# EAGLE design ug_in_A (EAGLE 9.0.1)
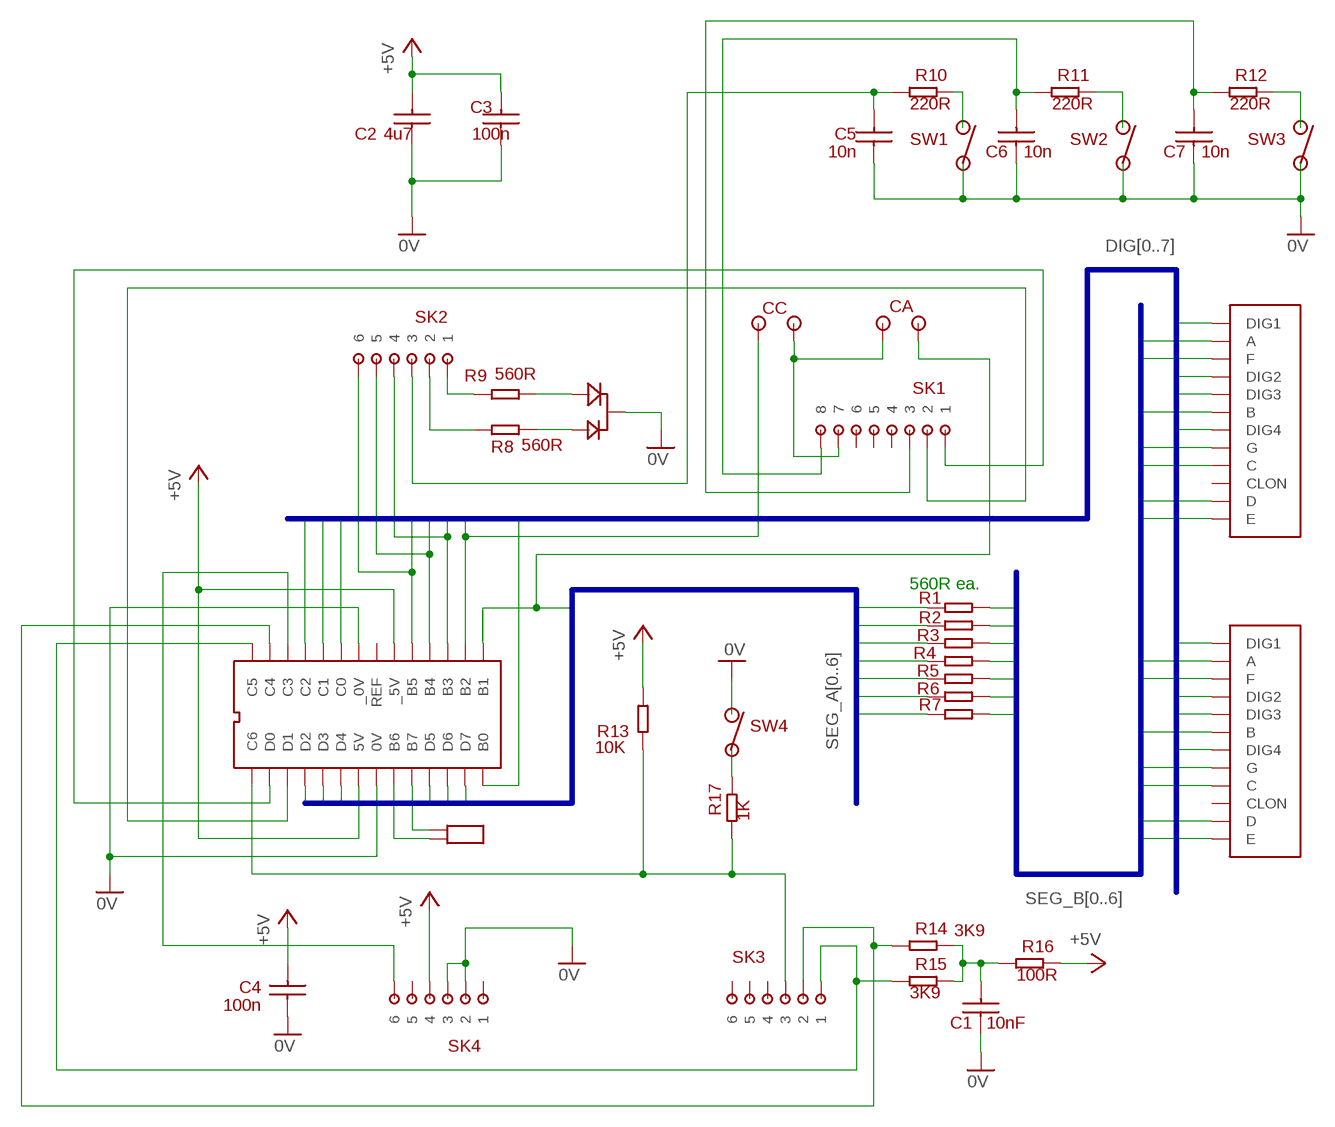
[diagram p0: schematic, sheet 1]

## Parts
C1  10nF  CAPACITOR  [1206]
C2  4u7  CAPACITOR  [1206]
C3  100n  CAPACITOR  [1206]
C4  100n  CAPACITOR  [1206]
C5  10n  CAPACITOR  [1206]
C6  10n  CAPACITOR  [1206]
C7  10n  CAPACITOR  [1206]
CA  CA_LINK  [CA_LINK]
CC  CA_LINK  [CA_LINK]
R1  560R  RESISTOR  [1206]
R2  560R  RESISTOR  [1206]
R3  560R  RESISTOR  [1206]
R4  560R  RESISTOR  [1206]
R5  560R  RESISTOR  [1206]
R6  560R  RESISTOR  [1206]
R7  560R  RESISTOR  [1206]
R8  560R  RESISTOR  [1206]
R9  560R  RESISTOR  [1206]
R10  220R  RESISTOR  [1206]
R11  220R  RESISTOR  [1206]
R12  220R  RESISTOR  [1206]
R13  10K  RESISTOR  [1206]
R14  3K9  RESISTOR  [1206]
R15  3K9  RESISTOR  [1206]
R16  100R  RESISTOR  [1206]
R17  1K  RESISTOR  [1206]
SK1  8_WAY_HEADER  [8_WAY_HEADER]
SK2  6_WAY_HEADER  [6_WAY_HEADER]
SK3  6_WAY_HEADER  [6_WAY_HEADER]
SK4  6_WAY_HEADER  [6_WAY_HEADER]
SW1  BP_TH_NO  [PB_NO_TH]
SW2  BP_TH_NO  [PB_NO_TH]
SW3  BP_TH_NO  [PB_NO_TH]
SW4  PUSH_BUTTON_NO_SM  [PUSH_BUTTON_NO_SM]
U$2  ATMEGA328DIP28_3  [DIL28-3]
U$3  DISPLAY  [DISPLAY]
U$4  DISPLAY  [DISPLAY]
U$5  CC_LED  [DUAL_LED]
U$16  CRYSTAL  [CRYSTAL]

## Nets
0V: C1.P$1 C2.P$1 C3.P$1 C4.P$1 C5.P$1 C6.P$1 C7.P$1 SK4.P$2 SK4.P$3 SW1.P$2 SW2.P$2 SW3.P$2 SW4.P$1 U$2.8(0V) U$2.22(_0V) U$5.P$2
+5V: C2.P$2 C3.P$2 C4.P$2 R13.P$2 R16.P$2 SK4.P$4 U$2.7(5V) U$2.20(_5V)
DIG0: SK2.P$6 U$2.19(B5) U$3.P$12(DIG1)
DIG1: U$2.23(C0) U$3.P$9(DIG2)
DIG2: U$2.24(C1) U$3.P$8(DIG3)
DIG3: U$2.25(C2) U$3.P$6(DIG4)
DIG4: U$2.14(B0) U$4.P$12(DIG1)
DIG5: CC.P$2 U$2.16(B2) U$4.P$9(DIG2)
DIG6: SK2.P$4 U$2.17(B3) U$4.P$8(DIG3)
DIG7: SK2.P$5 U$2.18(B4) U$4.P$6(DIG4)
N$1: R8.P$1 U$5.P$1
N$2: SK4.P$6 U$2.26(C3)
N$3: U$2.10(B7) U$16.P$1
N$4: R9.P$1 U$5.P$3
N$5: R9.P$2 SK2.P$1
N$6: R8.P$2 SK2.P$2
N$7: SK1.P$1 U$2.2(D0)
N$8: SK1.P$2 U$2.3(D1)
N$9: R15.P$1 SK3.P$1 U$2.28(C5)
N$10: R14.P$1 SK3.P$2 U$2.27(C4)
N$11: R17.P$2 SW4.P$2
N$12: R10.P$2 SW1.P$1
N$13: R11.P$2 SW2.P$1
N$14: R12.P$2 SW3.P$1
N$15: C7.P$2 R12.P$1 SK1.P$3
N$16: U$2.9(B6) U$16.P$2
N$17: C5.P$2 R10.P$1 SK2.P$3
N$18: C6.P$2 R11.P$1 SK1.P$8
N$19: C1.P$2 R14.P$2 R15.P$2 R16.P$1
N$20: R13.P$1 R17.P$1 SK3.P$3 U$2.1(C6)
N$23: CA.P$2 CC.P$1 SK1.P$7
SEG_A0: CA.P$1 R1.P$1 U$2.15(B1)
SEG_A1: R2.P$1 U$2.4(D2)
SEG_A2: R3.P$1 U$2.5(D3)
SEG_A3: R4.P$1 U$2.6(D4)
SEG_A4: R5.P$1 U$2.11(D5)
SEG_A5: R6.P$1 U$2.12(D6)
SEG_A6: R7.P$1 U$2.13(D7)
SEG_B0: R1.P$2 U$3.P$11(A) U$4.P$11(A)
SEG_B1: R2.P$2 U$3.P$7(B) U$4.P$7(B)
SEG_B2: R3.P$2 U$3.P$4(C) U$4.P$4(C)
SEG_B3: R4.P$2 U$3.P$2(D) U$4.P$2(D)
SEG_B4: R5.P$2 U$3.P$1(E) U$4.P$1(E)
SEG_B5: R6.P$2 U$3.P$10(F) U$4.P$10(F)
SEG_B6: R7.P$2 U$3.P$5(G) U$4.P$5(G)
Unconnected: SK1.P$4 SK1.P$5 SK1.P$6 SK3.P$4 SK3.P$5 SK3.P$6 SK4.P$1 SK4.P$5 U$2.21(REF) U$3.P$3(CLON) U$4.P$3(CLON)

## Buses
SEG_A[0..6]
SEG_B[0..6]
DIG[0..7]

## Notes on the sheet
- 560R ea.

## Library data of the parts
C1-C7 = 1_home_library:CAPACITOR
CA CC = 1_home_library:CA_LINK
R1-R17 = 1_home_library:RESISTOR
SK1 = 1_home_library:8_WAY_HEADER
SK2-SK4 = 1_home_library:6_WAY_HEADER
SW1-SW3 = 1_home_library:BP_TH_NO
SW4 = 1_home_library:PUSH_BUTTON_NO_SM
U$2 = 1_home_library:ATMEGA328
U$3 U$4 = 1_home_library:DISPLAY
U$5 = 1_home_library:CC_LED
U$16 = 1_home_library:CRYSTAL

## Board
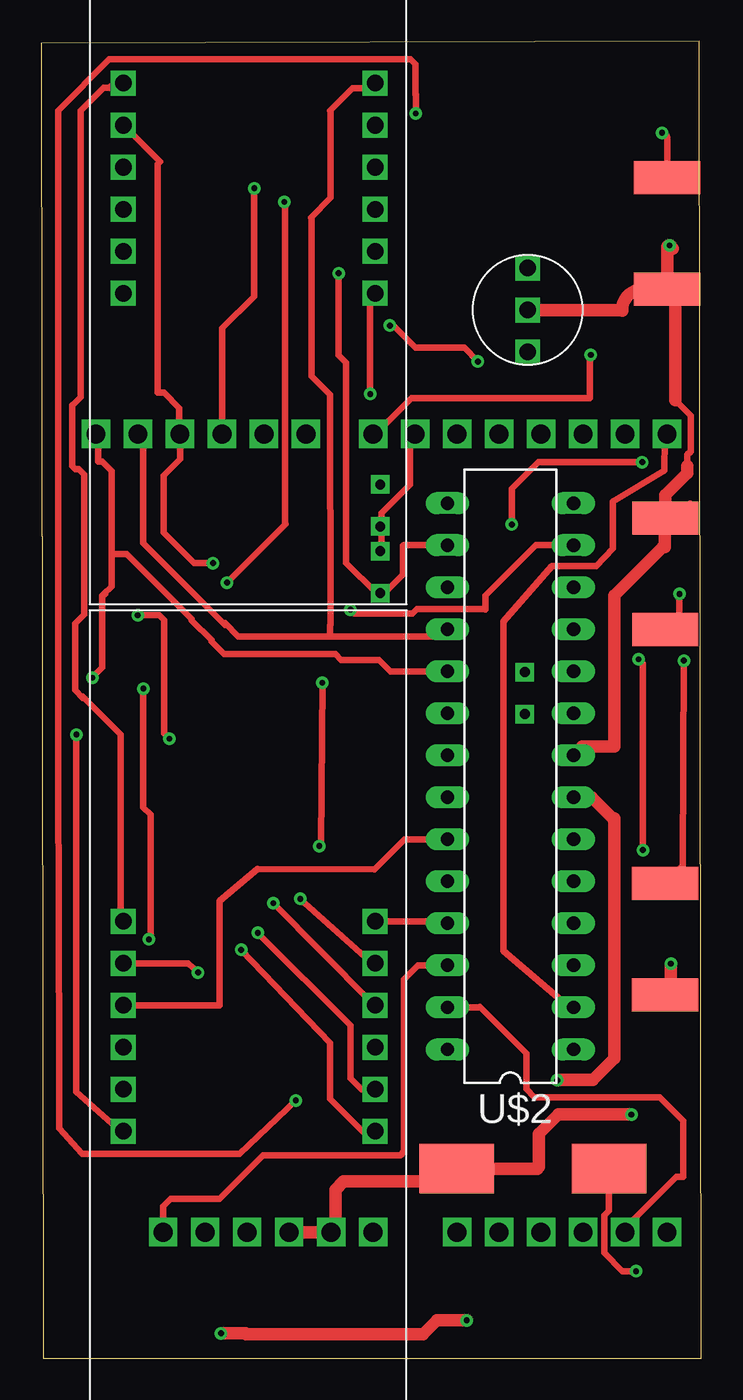
[diagram p1: board, top side]
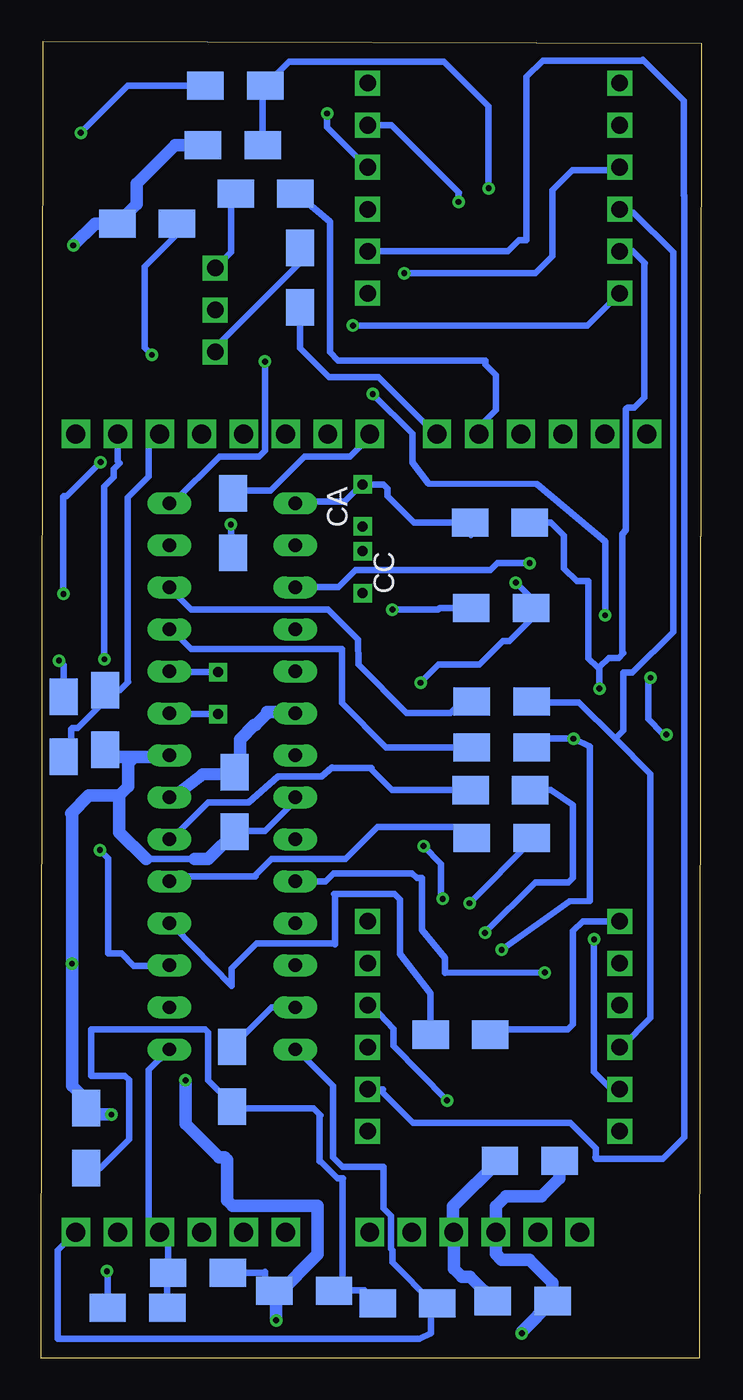
[diagram p2: board, bottom side, seen from below]

Size 39.93 x 79.62 mm. Coordinates in mm from the lower left corner, seen from the top.
Outline: 0.13,0 39.93,0 39.8,79.62 0,79.49 0.13,0
Copper layers (1*16): Top 0.035mm / dielectric 1.5mm / Bottom 0.035mm
Design rules "default *": minimum track width 15mil, minimum drill 0.35mm, track to track 12mil, track to pad 8mil, pad to pad 8mil, via to via 8mil, smd to smd 8mil, copper to edge 15mil, drill to drill 6mil, minimum pad ring 10mil, minimum via ring 8mil, stop-mask expansion 4mil, vias tented up to drill 0mil, thermal gap 10mil

### Footprints (pad centres in the part's own frame; a part is rotated, then mirrored left to right if it is on the bottom)
1206 = smd 2.2 x 1.7: P$1 0,0; P$2 3.61,0
CA_LINK = drill 0.6 square: P$1 0,2.54; P$2 0,0
8_WAY_HEADER = drill 1.143 square: P$1 0,0; P$2 0,-2.54; P$3 0,-5.08; P$4 0,-7.62; P$5 0,-10.16; P$6 0,-12.7; P$7 0,-15.24; P$8 0,-17.78
6_WAY_HEADER = drill 1.143 square: P$1 0,0; P$2 0,-2.54; P$3 0,-5.08; P$4 0,-7.62; P$5 0,-10.16; P$6 0,-12.7
PB_NO_TH = smd 2 x 4: P$1 0,0; P$2 6.75,0
PUSH_BUTTON_NO_SM = smd 3 x 4.5: P$1 -0.03,-0.78; P$2 -0.03,8.42
DIL28-3 = drill 0.813 long: 1 -16.51,-3.81; 2 -13.97,-3.81; 3 -11.43,-3.81; 4 -8.89,-3.81; 5 -6.35,-3.81; 6 -3.81,-3.81; 7 -1.27,-3.81; 8 1.27,-3.81; 9 3.81,-3.81; 10 6.35,-3.81; 11 8.89,-3.81; 12 11.43,-3.81; 13 13.97,-3.81; 14 16.51,-3.81; 15 16.51,3.81; 16 13.97,3.81; 17 11.43,3.81; 18 8.89,3.81; 19 6.35,3.81; 20 3.81,3.81; 21 1.27,3.81; 22 -1.27,3.81; 23 -3.81,3.81; 24 -6.35,3.81; 25 -8.89,3.81; 26 -11.43,3.81; 27 -13.97,3.81; 28 -16.51,3.81
DISPLAY = drill 1 square: P$1 0,0; P$2 2.54,0; P$3 5.08,0; P$4 7.62,0; P$5 10.16,0; P$6 12.7,0; P$7 12.7,15.24; P$8 10.16,15.24; P$9 7.62,15.24; P$10 5.08,15.24; P$11 2.54,15.24; P$12 0,15.24
DUAL_LED = drill 1 square: P$1 0,2.54; P$2 0,0; P$3 0,-2.54
CRYSTAL = drill 0.6 square: P$1 0,0; P$2 0,-2.54

### Placement (x,y rotation side)
C1  37.21,15.11 270 bottom
C2  12.62,3.45 0 bottom
C3  28.24,31.83 90 bottom
C4  12.19,11.94 0 bottom
C5  30.15,73.33 0 bottom
C6  35.33,68.61 0 bottom
C7  36.07,36.78 90 bottom
CA  20.5,50.29 0 bottom
CC  20.5,46.25 0 bottom
R1  14,50.52 0 bottom
R2  16.38,19.56 0 bottom
R3  13.89,31.45 0 bottom
R4  13.97,34.34 0 bottom
R5  13.89,36.93 0 bottom
R6  13.89,39.7 0 bottom
R7  13.92,45.36 0 bottom
R8  28.17,70.41 0 bottom
R9  24.28,67.13 270 bottom
R10  26.39,76.94 180 bottom
R11  28.32,52.3 270 bottom
R12  38.58,36.37 90 bottom
R13  32.26,5.16 0 bottom
R14  28.4,18.82 270 bottom
R15  15.98,3.33 180 bottom
R16  22.23,4.06 180 bottom
R17  32.31,3.05 180 bottom
SK1  37.85,55.88 270 top
SK2  16,55.88 270 top
SK3  37.85,7.62 270 top
SK4  20.07,7.62 270 top
SW1  37.85,71.37 270 top
SW2  37.74,44.04 90 top
SW3  37.72,28.7 270 top
SW4  25.91,11.43 270 top
U$2  28.37,35.18 90 top
U$3  20.19,13.72 90 top
U$4  20.19,64.39 90 top
U$5  29.41,63.37 0 top
U$16  29.24,41.48 0 top

### Tracks (layer width: path | path; a pad name or v marks a point on that pad's centre or on a via)
0V  (via drill 0.35)
  Top 0.381: 32.23,36.35 U$2.8 32.23,36.69 | SW2.P$2 37.72,50.24 39.25,51.67 | SW4.P$1 25.25,11.46 | 29.99,11.46 30,11.46 30.1,11.56 | 38.08,22.31 SW3.P$2 | 29.15,63.44 U$5.P$2 29.49,63.44 | 39.08,53.95 39.08,54.64 39.27,54.83 39.27,57 38.35,57.91
  Top 0.762: 37.72,50.24 37.72,49.03 37.58,49.03 34.65,46.1 34.65,36.98 32.72,36.98 U$2.8 | 29.99,11.46 25.25,11.46 24.48,10.69 18.29,10.69 17.78,10.19 17.78,7.87 SK4.P$2 SK4.P$3 | 30.1,11.56 30.1,13.56 31.27,14.73 v35.69,14.73 | v38.08,23.85 38.08,22.31 | SW2.P$2 37.74,52.17 39.08,53.51 39.08,53.95 | U$5.P$2 35.13,63.37 | 35.13,63.37 35.15,63.35 | 38.2,67.08 v38,67.28 arc90 37.85,67.13 SW1.P$2 | SW1.P$2 arc-90 38.35,64.12 38.35,57.91 | 35.13,63.37 arc-90 36.38,64.62 SW1.P$2
  Bottom 0.381: U$2.22 24.69,33.6 26.4,31.89 28.12,31.89 C3.P$1 28.46,31.55 | 32.23,36.35 U$2.8 32.23,36.69 | 37.03,15.43 C1.P$1 36.83,14.73 | 33.6,30.18 30.67,30.18 | 12.34,12 C4.P$1 | 29.49,63.44 U$5.P$2
  Bottom 0.762: v35.69,14.73 36.83,14.73 | C4.P$1 12.27,11.94 15.04,9.17 15.04,7.67 SK4.P$3 14.99,5.41 14.5,4.93 14.02,4.93 13.16,4.06 13.16,3.61 12.78,3.61 C2.P$1 | 37.03,15.43 38.08,16.47 v38.08,23.85 38.08,32.89 38.12,32.94 37.06,34.01 35.23,34.01 | 35.23,34.01 34.67,34.57 34.67,35.97 34.29,36.35 | 34.29,36.35 32.23,36.35 | 33.6,30.18 35.23,31.8 35.23,34.01 | C7.P$1 35.64,36.35 34.29,36.35 | 30.67,30.18 29.83,30.18 28.12,31.89 | v38,67.28 36.68,68.61 C6.P$1 34.16,69.77 34.16,71.02 31.85,73.33 C5.P$1
+5V  (via drill 0.35)
  Top 0.381: 34.67,18.8 34.59,18.72
  Top 0.762: v25.73,2.29 23.93,2.29 23.09,1.45 12.39,1.45 12.34,1.5 v10.87,1.5 | v31.2,16.8 31.22,16.82 33.35,16.82 34.67,18.14 34.67,18.8 34.67,32.64 34.57,32.64 33.3,33.91 U$2.7
  Bottom 0.381: 28.46,35.32 C3.P$2 28.73,35.88 | 31.89,33.95 U$2.7 | 26.4,4.12 26.06,4.12 R16.P$2 | 25.72,3.73 25.72,3.81 25.72,4.12 R16.P$2 | 26.4,4.12 26.4,5.23 26.48,5.16 R13.P$2 | 26.4,4.12 R16.P$2
  Bottom 0.762: 28.46,35.32 30.19,35.29 31.89,33.95 | C4.P$2 8.58,10.87 9.68,9.78 11.84,9.78 12.45,9.17 SK4.P$4 12.45,6.3 12.09,5.94 10.41,5.94 9.01,4.54 C2.P$2 10.87,1.6 v10.87,1.5 | v25.73,2.29 v25.72,2.3 25.72,3.73 | v31.2,16.8 31.2,14.16 29.18,12.14 28.85,12.14 28.7,11.99 28.7,9.55 28.37,9.22 23.22,9.22 23.22,6.27 25.68,3.81 25.72,3.81 | C3.P$2 27.91,35.77 27.91,37.41 27.05,38.28 26.98,38.28 26.26,38.99 26.26,39.06 24.64,39.06 U$2.20
DIG0  (via drill 0.35)
  Top 0.381: SK2.P$6 3.43,55.55 3.43,54.22 3.67,54.22 4.24,53.65 4.24,48.62 | v2.12,37.71 2.1,16.09 4.8,13.72 U$3.P$12 | 3.86,46.2 3.79,46.2 | 3.79,46.2 3.68,46.1 3.68,41.76 3.09,41.16 v3.09,41.13 | 4.24,48.62 5.16,48.62 9.09,44.68 9.09,44.6 10.29,43.41 10.29,43.33 11.05,42.57 17.78,42.57 18.14,42.22 20.42,42.22 21.11,41.53 U$2.19 | 3.79,46.2 4.24,46.66 4.24,48.62
  Bottom 0.381: v3.09,41.13 3.23,41 3.23,38.63 2.38,37.78 v2.12,37.71
DIG1
  Top 0.381: 24.35,31.2 U$2.23 21.97,31.37 20.14,29.54 13.08,29.57 10.77,27.66 10.77,21.34 U$3.P$9
DIG2  (via drill 0.35)
  Top 0.381: U$3.P$8 8.89,23.88 v9.47,23.32
  Bottom 0.381: 24.35,28.8 U$2.24 22.73,28.83 22.25,29.31 17.5,29.31 17.22,29.03 16.92,29.03 16.92,25.88 15.52,24.21 15.52,23.29 v9.47,23.32
DIG3
  Top 0.381: U$2.25 24.35,26.4 20.23,26.4 U$3.P$6
DIG4  (via drill 0.35)
  Top 0.381: v26.4,60.26 25.58,61.09 22.63,61.09 21.29,62.43 v21.08,62.43
  Bottom 0.381: v26.4,60.26 26.4,54.86 26.75,54.52 29.15,54.52 31.89,51.78 U$2.14 | v21.08,62.43 6.91,62.43 U$4.P$12
DIG5  (via drill 0.35)
  Top 0.381: 20.57,46.29 CC.P$2 | 24.35,49.03 U$2.16 24.54,49.17 21.92,49.17 21.87,49.12 21.87,47.37 20.75,46.25 CC.P$2 | CC.P$2 20.23,46.29 18.44,48.08 18.44,60.2 17.98,60.66 v17.98,65.6
  Bottom 0.381: U$4.P$9 5.14,71.82 7.81,71.82 9.02,70.61 9.02,66.64 10.06,65.6 v17.98,65.6
DIG6  (via drill 0.35)
  Top 0.381: 8.57,55.55 SK2.P$4 | U$4.P$8 5.14,74.41 7.2,72.35 7.04,72.19 7.04,58.37 7.42,58.37 8.33,57.45 8.33,55.93 SK2.P$4 | 8.23,55.89 SK2.P$4 | SK2.P$4 8.38,54.36 7.39,53.37 7.39,49.91 9.23,48.07 v10.39,48.07
  Bottom 0.381: U$2.17 24.35,46.63 21.95,46.63 20.92,47.66 12.76,47.66 12.36,48.07 v10.39,48.07
DIG7
  Top 0.381: SK2.P$5 6.17,55.55 6.17,52.81 6.15,52.78 6.15,49.28 11.1,44.32 11.1,44.45 11.91,43.64 17.45,43.64 | U$2.18 24.13,43.64 17.45,43.64 | 17.45,43.64 17.45,44.31 17.49,44.35 17.46,58.27 16.36,59.37 16.36,68.91 16.31,68.96 17.5,70.16 17.5,75.39 17.46,75.42 18.82,76.78 19.89,76.78 U$4.P$6
N$1
  Bottom 0.381: U$5.P$1 28.46,66.86 28.46,70.29 R8.P$1
N$2
  Top 0.381: U$2.26 22.78,23.75 21.95,22.91 21.95,12.5 21.72,12.27 13.41,12.27 10.77,9.63 7.82,9.63 7.37,9.17 SK4.P$6
N$3
  Bottom 0.381: U$16.P$1 32.13,41.48 U$2.10
N$4
  Bottom 0.381: R9.P$1 24.35,66.86 24.35,66.18 29.49,61.04 U$5.P$3
N$5
  Bottom 0.381: 24,63.44 R9.P$2 24.28,61.06 22.54,59.32 19.55,59.32 16.12,55.89 SK2.P$1
N$6
  Bottom 0.381: R8.P$2 24.35,70.29 22.47,68.72 22.47,60.82 21.97,60.33 13.06,60.33 13.06,60.07 12.42,59.44 12.42,57.33 13.46,56.29 SK2.P$2
N$7
  Top 0.381: U$2.2 31.89,21.26 27.95,24.61 27.95,44.55 30.87,47.88 33.57,47.9 34.56,48.95 34.56,51.8 37.69,53.67 37.72,55.55 SK1.P$1
N$8  (via drill 0.35)
  Top 0.381: v36.12,42.25 36.39,41.99 v36.39,30.72
  Bottom 0.381: v36.39,30.72 35.89,30.23 35.89,24.46 35.08,24.46 34.34,23.72 32.21,23.72 U$2.3 | SK1.P$2 35.31,54.25 35.18,54.13 35.56,53.75 35.56,53.26 36.12,52.7 v36.12,42.25
N$9
  Bottom 0.381: U$2.28 24.35,18.52 22.29,16.46 22.29,12.13 21.72,11.56 19.23,11.56 19.23,9.05 18.78,8.6 18.78,6.6 18.69,6.52 18.69,5.79 16.23,3.33 R15.P$1 16.36,2.95 16.36,1.5 17.07,1.17 38.94,1.17 38.94,6.53 SK3.P$1
N$10
  Top 0.381: SK3.P$2 35.32,7.89 38.41,10.97 38.84,10.97 38.84,14.35 37.41,15.77 29.83,15.77 29.34,16.27 29.34,18.41 26.52,21.23 26.49,21.21 U$2.27 24.69,20.92
  Bottom 0.381: 28.12,18.86 R14.P$1 26.01,21.21 U$2.27 24.69,20.92
N$11  (via drill 0.35)
  Top 0.381: 34.29,11.32 SW4.P$2 34.33,8.91 34.05,8.64 34.05,6.36 35.15,5.26 v35.97,5.26
  Bottom 0.381: v35.97,5.26 35.92,5.21 R17.P$2
N$12  (via drill 0.35)
  Top 0.381: 37.85,73.79 v37.54,74.09 arc-90 37.85,73.79 | 37.85,73.79 SW1.P$1
  Bottom 0.381: v37.54,74.09 34.7,76.94 R10.P$2
N$13  (via drill 0.35)
  Top 0.381: 37.72,43.89 37.38,44.23 | 37.72,43.89 SW2.P$1 | v38.59,46.2 38.59,44.77 37.72,43.89 | v28.46,50.41 28.46,52.56 30.07,54.18 v36.35,54.18
  Bottom 0.381: v28.46,50.41 28.46,48.69 R11.P$2 | v38.59,46.2 38.59,52.11 38.58,52.12 38.41,52.12 v36.35,54.18
N$14  (via drill 0.35)
  Top 0.381: SW3.P$1 38.81,29.79 v38.86,42.18
  Bottom 0.381: v38.86,42.18 38.58,41.9 R12.P$2
N$15
  Bottom 0.381: SK1.P$3 33.43,55.22 33.43,53.31 34.7,52.05 34.7,40.89 34.67,40.87 35.15,40.39 C7.P$2 36.07,39.75 37.72,38.1 38.08,38.1 38.12,38.05 38.12,36.83 R12.P$1
N$16
  Bottom 0.381: U$16.P$2 32.13,38.94 U$2.9
N$17  (via drill 0.35)
  Top 0.381: SK2.P$3 10.95,62.28 12.88,64.19 v12.88,70.74
  Bottom 0.381: v12.88,70.74 12.88,75.69 15.57,78.38 24.94,78.38 R10.P$1 26.54,76.79 C5.P$2
N$18  (via drill 0.35)
  Top 0.381: SK1.P$8 20.23,55.89 22.38,58.04 33.17,58.04 33.17,60.6 v33.24,60.67
  Bottom 0.381: R11.P$1 28.12,52.46 26.06,52.46 24,54.52 21.26,54.52 20.23,55.55 SK1.P$8 | v33.24,60.67 33.68,61.11 33.68,65.99 31.72,67.95 C6.P$2
N$19
  Bottom 0.381: 28.12,15.09 R14.P$2 | 37.03,11.66 C1.P$2 | R14.P$2 28.46,15.43 29.83,16.8 29.83,19.7 30.02,19.89 36.91,19.89 36.91,17.07 34.87,17.07 34.62,16.82 34.62,13.23 36.35,11.5 C1.P$2 | C1.P$2 37.13,11.58 | R14.P$2 28.3,15.11 23.47,15.11 23.04,14.68 23.11,14.61 23.11,11.91 23.04,11.91 22,10.87 21.69,10.87 21.7,10.86 21.7,4.83 22.29,4.12 R16.P$1 21.95,4.12 20.37,4.12 R15.P$2
N$20
  Bottom 0.381: 32.23,18.52 U$2.1 33.43,17.42 33.43,8.05 32.92,7.54 | 32.92,7.54 SK3.P$3 | R13.P$1 32.26,6.88 32.92,7.54 | R13.P$1 32.92,4.5 | R17.P$1 32.31,5.11 R13.P$1
N$23
  Top 0.381: CC.P$1 20.57,49.03 20.57,50.06 CA.P$2 20.57,50.41 20.57,51.09 22.29,52.81 22.29,55.55 SK1.P$7
SEG_A0
  Bottom 0.381: 20.23,52.81 CA.P$1 20.57,52.81 | 20.57,52.81 21.6,51.78 24.35,51.78 U$2.15 | 13.95,49.76 R1.P$1 17.4,50.52 19,52.12 19,52.58 19.23,52.81 20.57,52.81
SEG_A1
  Bottom 0.381: 16.46,19.89 16.41,19.67 | 16.41,19.67 R2.P$1 | U$2.4 31.89,26.06 28.43,22.5 28.43,23.56 26.92,25.07 22.23,25.07 22.17,25.02 22.17,28.02 22.23,28.07 18.57,28.07 18.24,27.74 18.24,24.43 16.41,22.04 16.41,19.67
SEG_A2
  Bottom 0.381: 31.2,29.15 31.89,29.15 32.06,28.96 | 32.06,28.96 U$2.5 | 32.06,28.96 31.89,29.13 26.98,29.13 26.98,29.21 26.01,30.18 21.54,30.18 19.58,32.13 14.58,32.13 R3.P$1
SEG_A3
  Bottom 0.381: U$2.6 31.89,31.55 29.83,33.6 27.38,33.6 25.62,35.17 22.98,35.17 22.36,35.71 22.33,35.69 19.96,35.69 19.96,35.59 18.72,34.34 R4.P$1
SEG_A4
  Bottom 0.381: U$2.11 31.89,43.89 30.86,42.86 21.75,42.86 21.75,39.61 19.07,36.93 R5.P$1
SEG_A5
  Bottom 0.381: U$2.12 31.89,46.29 30.86,45.26 22.58,45.26 20.78,43.46 20.75,41.94 17.83,39.01 15.19,39.01 14.45,39.75 13.95,39.75 13.89,39.8 R6.P$1
SEG_A6  (via drill 0.35)
  Top 0.381: 31.2,49.03 31.89,49.03 U$2.13 29.92,49.15 26.87,46.1 26.87,45.26 26.85,45.29 22.73,45.29 22.45,45.01 18.95,45.01 v18.69,45.26
  Bottom 0.381: v18.69,45.26 15.93,45.26 15.82,45.36 R7.P$1
SEG_B0  (via drill 0.35)
  Top 0.381: v6.17,40.49 6.17,33.3 6.6,32.87 6.6,25.43 v6.5,25.32
  Bottom 0.381: 5.14,66.86 U$4.P$11 4.14,66.93 3.43,66.22 3.45,66.19 3.45,58.09 4.06,57.48 4.47,57.48 4.57,57.38 4.57,50.06 4.8,49.84 4.8,42.7 4.72,42.62 5,42.34 5.61,42.34 6.17,41.78 | 6.17,41.78 v6.17,40.49 | 6.17,41.78 6.3,41.78 6.83,42.32 6.83,44.55 6.86,44.58 6.86,46.98 7.55,46.98 8.33,47.76 8.33,49.73 9.12,50.52 R1.P$2 | v6.5,25.32 6.5,17.3 5.46,16.26 U$3.P$11
SEG_B1
  Top 0.381: U$3.P$7 4.8,26.75 4.8,37.72 2.52,40.01 2.52,39.93 2.06,40.39 2.06,44.42 2.59,44.96 2.59,53.42 2.26,53.75 2.06,53.75 1.85,53.95 1.85,57.63 1.91,57.63 2.39,58.12 2.39,75.44 3.76,76.81 4.12,76.81 4.39,77.09 U$4.P$7
  Bottom 0.381: R2.P$2 12.69,19.89 8.08,19.89 7.77,20.19 7.77,25.83 7.19,26.42 U$3.P$7 4.8,26.4
SEG_B2  (via drill 0.35)
  Top 0.381: v14.03,27.51 19.89,21.6 U$3.P$4 | v15.39,15.58 12,12.34 2.46,12.34 1.08,13.91 1.05,30.32 1.03,31.89 1.03,75.44 4.12,78.52 22.31,78.52 22.33,78.54 22.63,78.23 22.63,76.4 22.64,76.39 v22.64,75.26
  Bottom 0.381: v15.39,15.58 18.63,18.87 18.63,19.9 19.89,21.26 U$3.P$4 | U$4.P$4 20.23,72.01 22.64,74.42 v22.64,75.26 | v14.03,27.51 10.28,31.26 R3.P$2
SEG_B3  (via drill 0.35)
  Top 0.381: 19.89,16.46 U$3.P$2 19.36,16.26 18.69,16.92 18.69,20.12 v13.09,25.72
  Bottom 0.381: 19.28,16.26 U$3.P$2 19.48,16.26 17.45,14.22 7.92,14.22 6.4,12.7 6.4,12.12 | R4.P$2 9.12,34.34 7.79,33.44 7.79,29.05 8.05,28.78 10.06,28.78 13.09,25.74 v13.09,25.72 | U$4.P$2 11.71,66.93 11.05,67.59 10.59,67.59 10.59,77.47 9.6,78.46 3.61,78.46 3.56,78.51 1.07,76.02 1.07,70.33 1.03,70.29 1.03,13.35 2.34,12.04 6.33,12.04 6.4,12.12 | 6.43,12.14 6.4,12.12 | 6.4,12.12 6.4,12.06
SEG_B4  (via drill 0.35)
  Top 0.381: 20.23,13.72 U$3.P$1 19.43,13.72 17.48,15.67 17.48,19.07 v12.09,24.69 | v19.89,58.29 19.89,64.12 U$4.P$1 | v5.83,44.92 7.12,44.92 7.42,44.63 7.42,37.78 v7.75,37.45
  Bottom 0.381: v19.89,58.29 17.49,55.89 17.49,54.15 16.52,52.88 9.97,52.86 5.83,49.38 v5.83,44.92 | v12.09,24.69 8,27.61 6.76,27.64 6.76,36.97 v7.75,37.45 9.76,37.45 R5.P$2
SEG_B5
  Bottom 0.381: 5.22,37.45 3.09,35.32 3.09,20.57 4.8,18.86 U$3.P$10 | U$4.P$10 4.8,69.27 4.12,69.27 1.71,66.86 1.71,43.92 4.18,41.45 4.72,41.45 4.72,37.95 5.22,37.45 | 5.22,37.45 7.42,39.65 10.23,39.65 R6.P$2
SEG_B6  (via drill 0.35)
  Top 0.381: v15.66,27.77 19.89,24 U$3.P$5 | 14.74,50.43 14.76,50.42 | v11.23,46.89 14.74,50.41 14.74,50.43 | v16.99,40.84 16.92,31.06 v16.82,30.96 | v14.69,69.91 14.74,69.86 14.74,50.43
  Bottom 0.381: 19.89,74.41 U$4.P$5 18.76,74.55 18.25,74.04 16.92,72.69 14.68,70.46 14.69,70.45 v14.69,69.91 | 10.45,45.51 R7.P$2 10.31,44.66 11.61,43.36 12,43.36 13.42,41.94 15.9,41.94 v16.99,40.84 | 10.45,45.51 10.69,45.75 | v11.23,46.89 10.45,46.11 10.45,45.51 | v16.82,30.96 15.75,29.9 15.75,27.86 v15.66,27.77